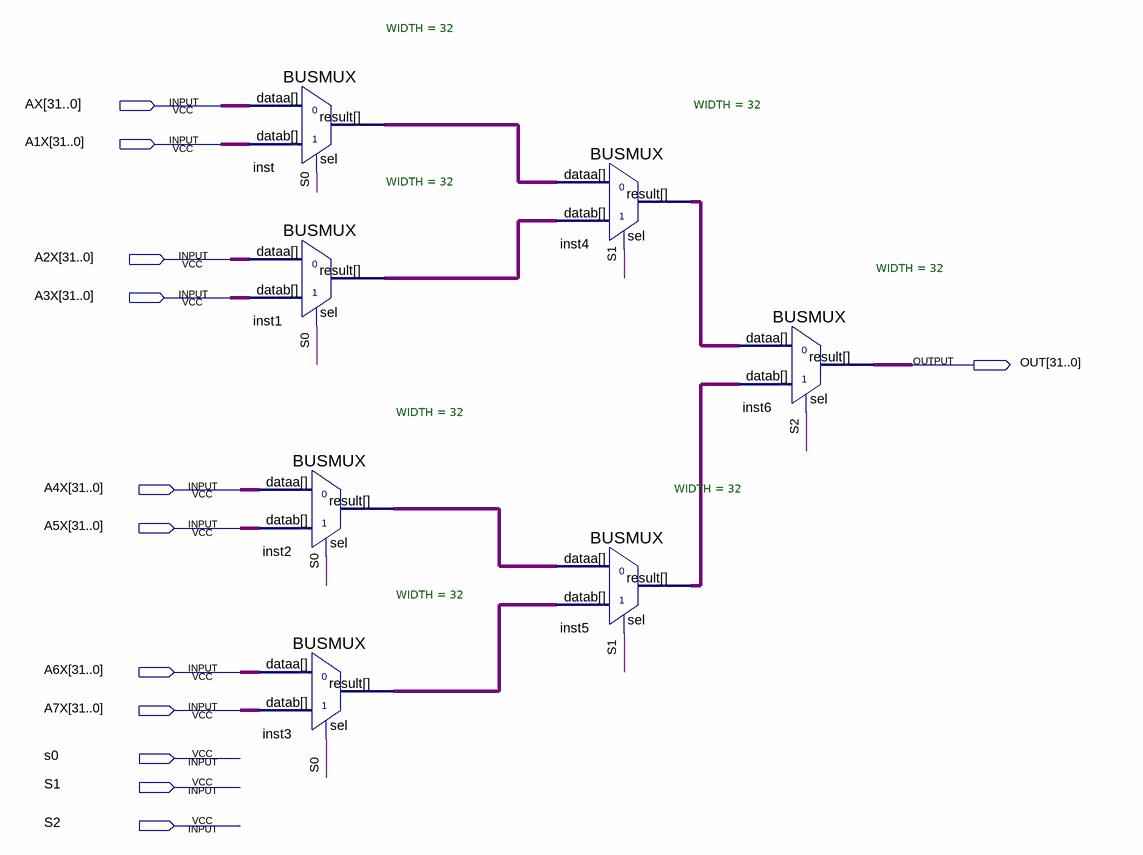
[diagram p0: schematic sheet]
// Quartus schematic mux8.bdf as structural Verilog: 7 symbols, 12 pins
module mux8 (
  input  [31:0] AX,
  input  [31:0] A1X,
  input  [31:0] A2X,
  input  [31:0] A3X,
  input  [31:0] A4X,
  input  [31:0] A5X,
  input  [31:0] A6X,
  input  [31:0] A7X,
  input  s0,
  input  S1,
  input  S2,
  output [31:0] OUT
);

  wire [31:0] inst1_result, inst2_result, inst3_result, inst4_result, inst5_result, inst_result;

  BUSMUX #(.WIDTH(32)) inst (.datab(A1X), .sel(s0), .dataa(AX), .result(inst_result));
  BUSMUX #(.WIDTH(32)) inst1 (.datab(A3X), .sel(s0), .dataa(A2X), .result(inst1_result));
  BUSMUX #(.WIDTH(32)) inst2 (.datab(A5X), .sel(s0), .dataa(A4X), .result(inst2_result));
  BUSMUX #(.WIDTH(32)) inst3 (.datab(A7X), .sel(s0), .dataa(A6X), .result(inst3_result));
  BUSMUX #(.WIDTH(32)) inst4 (.datab(inst1_result), .sel(S1), .dataa(inst_result), .result(inst4_result));
  BUSMUX #(.WIDTH(32)) inst5 (.datab(inst3_result), .sel(S1), .dataa(inst2_result), .result(inst5_result));
  BUSMUX #(.WIDTH(32)) inst6 (.datab(inst5_result), .sel(S2), .dataa(inst4_result), .result(OUT));
endmodule
